# EAGLE design picotouch_synth (EAGLE 9.6.2)
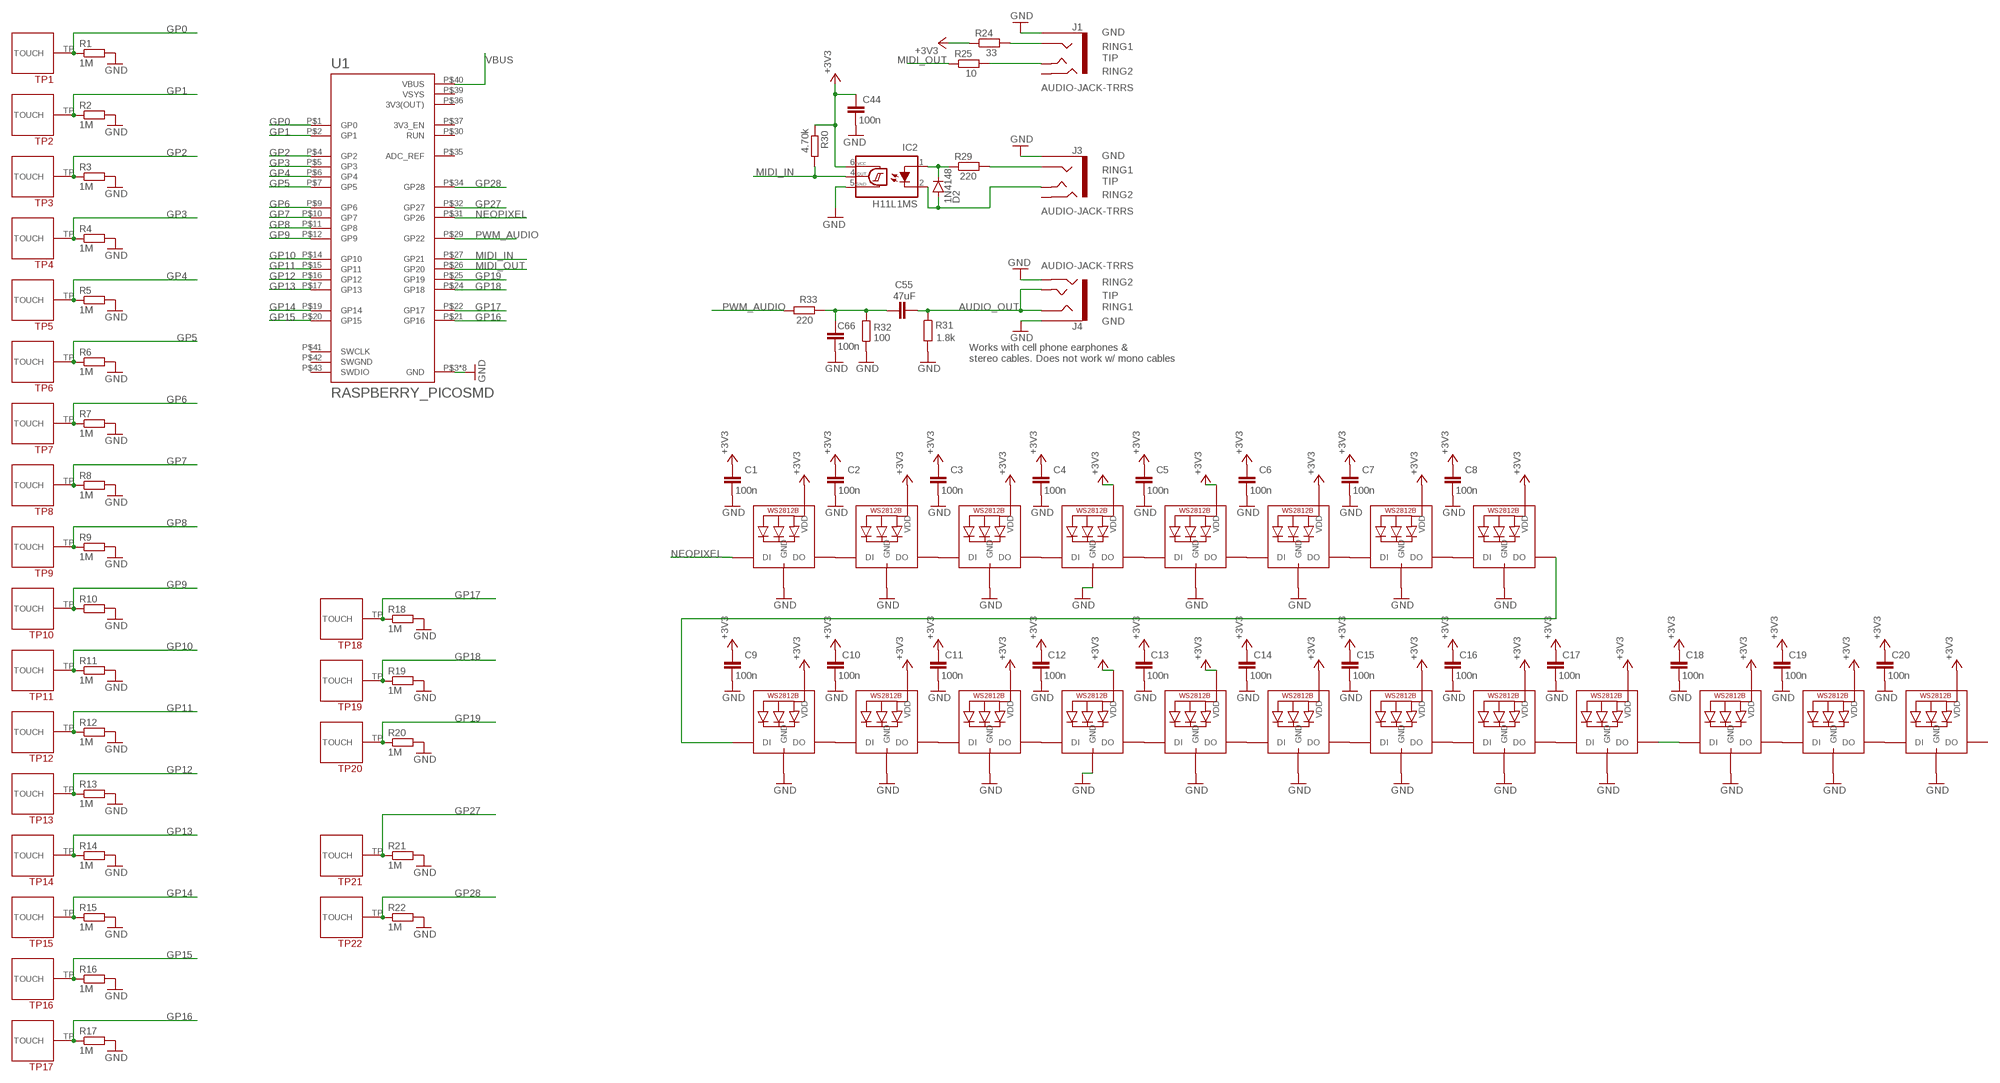
[diagram p0: schematic, sheet 1]

## Parts
C1  100n  C-EUC0603  [C0603]
C2  100n  C-EUC0603  [C0603]
C3  100n  C-EUC0603  [C0603]
C4  100n  C-EUC0603  [C0603]
C5  100n  C-EUC0603  [C0603]
C6  100n  C-EUC0603  [C0603]
C7  100n  C-EUC0603  [C0603]
C8  100n  C-EUC0603  [C0603]
C9  100n  C-EUC0603  [C0603]
C10  100n  C-EUC0603  [C0603]
C11  100n  C-EUC0603  [C0603]
C12  100n  C-EUC0603  [C0603]
C13  100n  C-EUC0603  [C0603]
C14  100n  C-EUC0603  [C0603]
C15  100n  C-EUC0603  [C0603]
C16  100n  C-EUC0603  [C0603]
C17  100n  C-EUC0603  [C0603]
C18  100n  C-EUC0603  [C0603]
C19  100n  C-EUC0603  [C0603]
C20  100n  C-EUC0603  [C0603]
C44  100n  C-EUC0603  [C0603]
C55  47uF  C-EUC0603  [C0603]
C66  100n  C-EUC0603  [C0603]
D2  1N4148  DIODE-SOD123  [SOD123]
IC2  H11L1MS  [DIL6-SMD]
J1  AUDIO-JACK-TRRS  [PJ-320D_SPARKFUN]
J3  AUDIO-JACK-TRRS  [PJ-320D_SPARKFUN]
J4  AUDIO-JACK-TRRS  [PJ-320D_SPARKFUN]
LED1  WS2812B3535  [LED3535]
LED2  WS2812B3535  [LED3535]
LED3  WS2812B3535  [LED3535]
LED4  WS2812B3535  [LED3535]
LED5  WS2812B3535  [LED3535]
LED6  WS2812B3535  [LED3535]
LED7  WS2812B3535  [LED3535]
LED8  WS2812B3535  [LED3535]
LED9  WS2812B3535  [LED3535]
LED10  WS2812B3535  [LED3535]
LED11  WS2812B3535  [LED3535]
LED12  WS2812B3535  [LED3535]
LED13  WS2812B3535  [LED3535]
LED14  WS2812B3535  [LED3535]
LED15  WS2812B3535  [LED3535]
LED16  WS2812B3535  [LED3535]
LED17  WS2812B3535  [LED3535]
LED18  WS2812B3535  [LED3535]
LED19  WS2812B3535  [LED3535]
LED20  WS2812B3535  [LED3535]
R1  1M  R-EU_R0805  [R0805]
R2  1M  R-EU_R0805  [R0805]
R3  1M  R-EU_R0805  [R0805]
R4  1M  R-EU_R0805  [R0805]
R5  1M  R-EU_R0805  [R0805]
R6  1M  R-EU_R0805  [R0805]
R7  1M  R-EU_R0805  [R0805]
R8  1M  R-EU_R0805  [R0805]
R9  1M  R-EU_R0805  [R0805]
R10  R-EU_R0805  [R0805]
R11  1M  R-EU_R0805  [R0805]
R12  1M  R-EU_R0805  [R0805]
R13  1M  R-EU_R0805  [R0805]
R14  1M  R-EU_R0805  [R0805]
R15  1M  R-EU_R0805  [R0805]
R16  1M  R-EU_R0805  [R0805]
R17  1M  R-EU_R0805  [R0805]
R18  1M  R-EU_R0603  [R0603]
R19  1M  R-EU_R0603  [R0603]
R20  1M  R-EU_R0603  [R0603]
R21  1M  R-EU_R0603  [R0603]
R22  1M  R-EU_R0603  [R0603]
R24  33  R-EU_R0603  [R0603]
R25  10  R-EU_R0603  [R0603]
R29  220  R-EU_R0603  [R0603]
R30  4.70k  R-EU_R0603  [R0603]
R31  1.8k  R-EU_R0603  [R0603]
R32  100  R-EU_R0603  [R0603]
R33  220  R-EU_R0603  [R0603]
TP1  TOUCHPADA  [TOUCHPADA]
TP2  TOUCHPADA  [TOUCHPADA]
TP3  TOUCHPADA  [TOUCHPADA]
TP4  TOUCHPADA  [TOUCHPADA]
TP5  TOUCHPADA  [TOUCHPADA]
TP6  TOUCHPADA  [TOUCHPADA]
TP7  TOUCHPADA  [TOUCHPADA]
TP8  TOUCHPADA  [TOUCHPADA]
TP9  TOUCHPADA  [TOUCHPADA]
TP10  TOUCHPADA  [TOUCHPADA]
TP11  TOUCHPADA  [TOUCHPADA]
TP12  TOUCHPADA  [TOUCHPADA]
TP13  TOUCHPADA  [TOUCHPADA]
TP14  TOUCHPADA  [TOUCHPADA]
TP15  TOUCHPADA  [TOUCHPADA]
TP16  TOUCHPADA  [TOUCHPADA]
TP17  TOUCHPADA  [TOUCHPADA]
TP18  TOUCHPADB  [TOUCHPADB]
TP19  TOUCHPADB  [TOUCHPADB]
TP20  TOUCHPADB  [TOUCHPADB]
TP21  TOUCHPADB  [TOUCHPADB]
TP22  TOUCHPADB  [TOUCHPADB]
U1  RASPBERRY_PICOSMD  [PICO-PKG-SMD]

## Nets
+3V3: C1.1 C2.1 C3.1 C4.1 C5.1 C6.1 C7.1 C8.1 C9.1 C10.1 C11.1 C12.1 C13.1 C14.1 C15.1 C16.1 C17.1 C18.1 C19.1 C20.1 C44.1 IC2.6(VCC) LED1.2(VDD) LED2.2(VDD) LED3.2(VDD) LED4.2(VDD) LED5.2(VDD) LED6.2(VDD) LED7.2(VDD) LED8.2(VDD) LED9.2(VDD) LED10.2(VDD) LED11.2(VDD) LED12.2(VDD) LED13.2(VDD) LED14.2(VDD) LED15.2(VDD) LED16.2(VDD) LED17.2(VDD) LED18.2(VDD) LED19.2(VDD) LED20.2(VDD) R24.1 R30.1
AUDIO_OUT: C55.2 J4.RING1 J4.TIP R31.1
GND: C1.2 C2.2 C3.2 C4.2 C5.2 C6.2 C7.2 C8.2 C9.2 C10.2 C11.2 C12.2 C13.2 C14.2 C15.2 C16.2 C17.2 C18.2 C19.2 C20.2 C44.2 C66.2 IC2.5(GND) J1.EARTH J3.EARTH J4.EARTH J4.RING2 LED1.4(GND) LED2.4(GND) LED3.4(GND) LED4.4(GND) LED5.4(GND) LED6.4(GND) LED7.4(GND) LED8.4(GND) LED9.4(GND) LED10.4(GND) LED11.4(GND) LED12.4(GND) LED13.4(GND) LED14.4(GND) LED15.4(GND) LED16.4(GND) LED17.4(GND) LED18.4(GND) LED19.4(GND) LED20.4(GND) R1.2 R2.2 R3.2 R4.2 R5.2 R6.2 R7.2 R8.2 R9.2 R10.2 R11.2 R12.2 R13.2 R14.2 R15.2 R16.2 R17.2 R18.2 R19.2 R20.2 R21.2 R22.2 R31.2 R32.1 U1.P$3(GND) U1.P$8(GND) U1.P$13(GND) U1.P$18(GND) U1.P$23(GND) U1.P$28(GND) U1.P$33(GND) U1.P$38(GND)
GP0: R1.1 TP1.TP(TOUCH) U1.P$1(GP0)
GP1: R2.1 TP2.TP(TOUCH) U1.P$2(GP1)
GP2: R3.1 TP3.TP(TOUCH) U1.P$4(GP2)
GP3: R4.1 TP4.TP(TOUCH) U1.P$5(GP3)
GP4: R5.1 TP5.TP(TOUCH) U1.P$6(GP4)
GP5: R6.1 TP6.TP(TOUCH) U1.P$7(GP5)
GP6: R7.1 TP7.TP(TOUCH) U1.P$9(GP6)
GP7: R8.1 TP8.TP(TOUCH) U1.P$10(GP7)
GP8: R9.1 TP9.TP(TOUCH) U1.P$11(GP8)
GP9: R10.1 TP10.TP(TOUCH) U1.P$12(GP9)
GP10: R11.1 TP11.TP(TOUCH) U1.P$14(GP10)
GP11: R12.1 TP12.TP(TOUCH) U1.P$15(GP11)
GP12: R13.1 TP13.TP(TOUCH) U1.P$16(GP12)
GP13: R14.1 TP14.TP(TOUCH) U1.P$17(GP13)
GP14: R15.1 TP15.TP(TOUCH) U1.P$19(GP14)
GP15: R16.1 TP16.TP(TOUCH) U1.P$20(GP15)
GP16: R17.1 TP17.TP(TOUCH) U1.P$21(GP16)
GP17: R18.1 TP18.TP(TOUCH) U1.P$22(GP17)
GP18: R19.1 TP19.TP(TOUCH) U1.P$24(GP18)
GP19: R20.1 TP20.TP(TOUCH) U1.P$25(GP19)
GP27: R21.1 TP21.TP(TOUCH) U1.P$32(GP27)
GP28: R22.1 TP22.TP(TOUCH) U1.P$34(GP28)
MIDI_IN: IC2.4(OUT) R30.2 U1.P$27(GP21)
MIDI_OUT: R25.1 U1.P$26(GP20)
N$1: D2.C IC2.1(A) R29.1
N$2: J1.TIP R25.2
N$3: D2.A IC2.2(C) J3.TIP
N$4: J3.RING1 R29.2
N$5: C55.1 C66.1 R32.2 R33.1
N$6: J1.RING1 R24.2
N$7: LED1.3(DO) LED2.1(DI)
N$8: LED4.3(DO) LED5.1(DI)
N$9: LED5.3(DO) LED6.1(DI)
N$10: LED6.3(DO) LED7.1(DI)
N$11: LED7.3(DO) LED8.1(DI)
N$12: LED2.3(DO) LED3.1(DI)
N$13: LED3.3(DO) LED4.1(DI)
N$14: LED9.3(DO) LED10.1(DI)
N$15: LED12.3(DO) LED13.1(DI)
N$16: LED13.3(DO) LED14.1(DI)
N$17: LED14.3(DO) LED15.1(DI)
N$18: LED15.3(DO) LED16.1(DI)
N$19: LED10.3(DO) LED11.1(DI)
N$20: LED11.3(DO) LED12.1(DI)
N$21: LED8.3(DO) LED9.1(DI)
N$22: LED16.3(DO) LED17.1(DI)
N$23: LED18.3(DO) LED19.1(DI)
N$25: LED19.3(DO) LED20.1(DI)
N$26: LED17.3(DO) LED18.1(DI)
NEOPIXEL: LED1.1(DI) U1.P$31(GP26)
PWM_AUDIO: R33.2 U1.P$29(GP22)
VBUS: U1.P$40(VBUS)
Unconnected: J1.RING2 J3.RING2 LED20.3(DO) U1.P$30(RUN) U1.P$35(ADC_REF) U1.P$37(3V3_EN) U1.P$41(SWCLK) U1.P$43(SWDIO)

## Notes on the sheet
- GND
- RING1
- TIP
- RING2
- GND
- RING1
- TIP
- RING2
- RING2
- TIP
- RING1
- GND
- Works with cell phone earphones &
  stereo cables. Does not work w/ mono cables

## Power pins joined to a net without a drawn wire
3V3(OUT): U1.P$36(3V3(OUT))
SWGND: U1.P$42(SWGND)
VSYS: U1.P$39(VSYS)

## Library data of the parts
C1-C20 C44 C55 C66 = rcl:C-EU: CAPACITOR, European symbol; SPICEPREFIX: C
D2 = diode:DIODE-: DIODE
IC2 = optocoupler:H11L*M: 6-Pin DIP Optocoupler Source: http://www.fairchildsemi.com/ds/H1/H11L2-M.pdf; LCSC: C78589; MPN2: H11L1S; OC_FARNELL: unknown; OC_NEWARK: unknown
J1 J3 J4 = audio_jacks_todbot:AUDIO-JACK-TRRS; LCSC: C431535; MPN: PJ-320D
LED1-LED20 = todstuff2023:WS2812B
R1-R22 R24 R25 R29-R33 = rcl:R-EU_: RESISTOR, European symbol; SPICEPREFIX: R
TP1-TP22 = todstuff:TOUCHPAD
U1 = RpiPico:RASPBERRY_PICO: Raspberry Pi Pico

## Net classes
1 power: width 0.305 mm

## Board
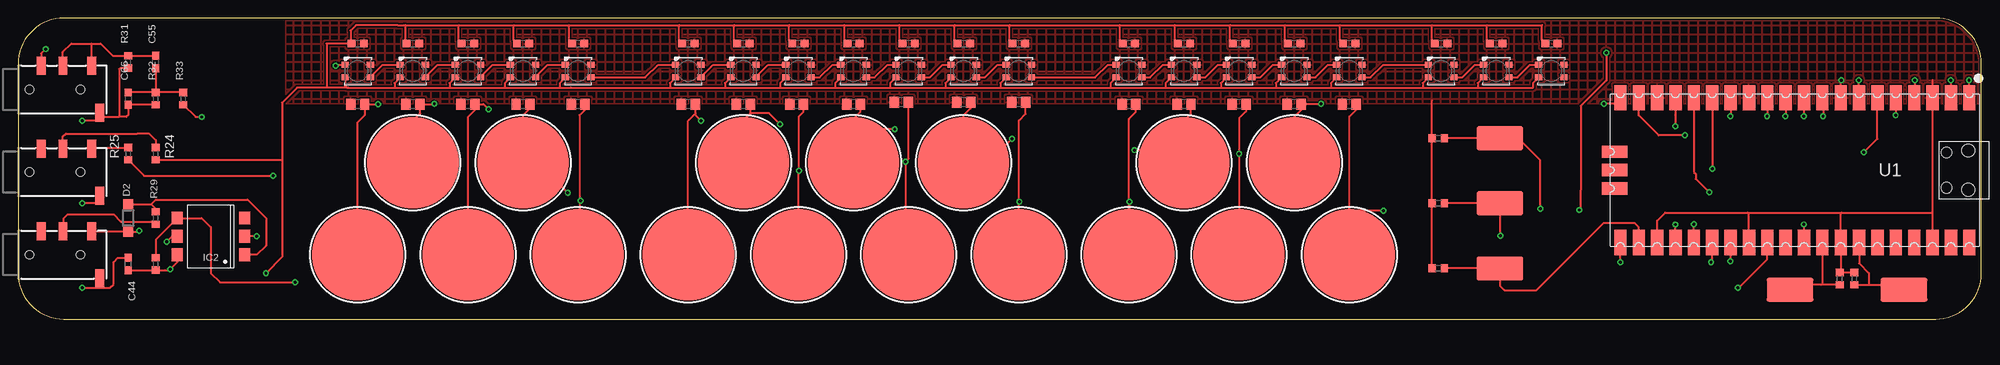
[diagram p1: board, top side]
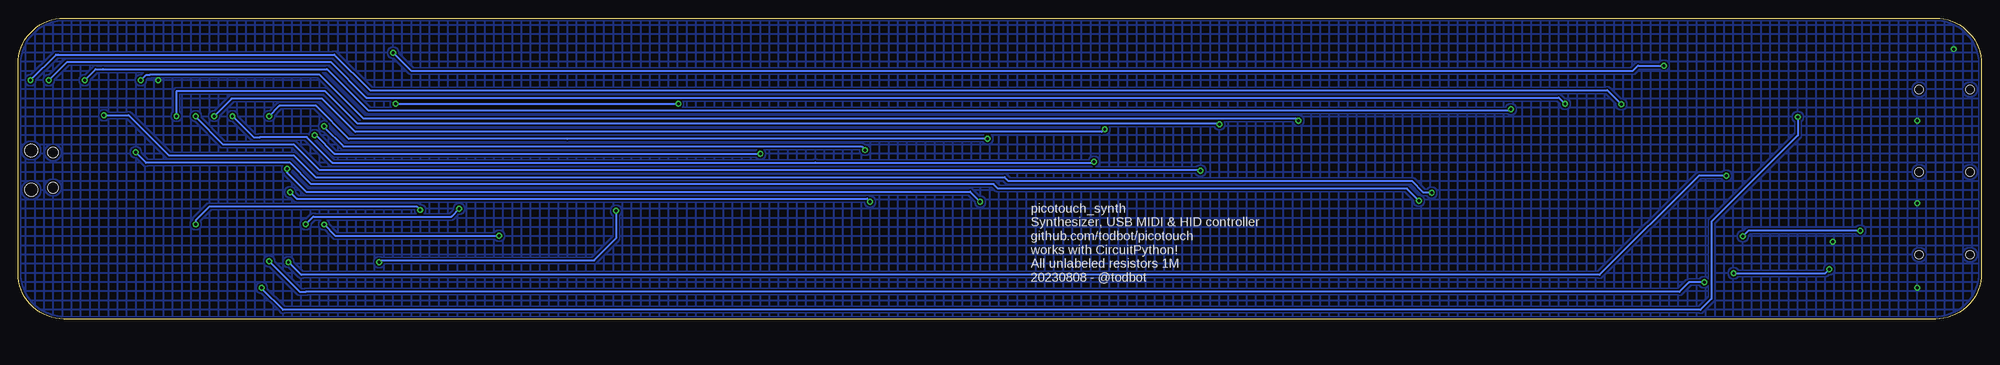
[diagram p2: board, bottom side, seen from below]

Size 271.59 x 41.62 mm. Coordinates in mm from the lower left corner, seen from the top.
Outline: 0,35.27 0,6.35 arc90 6.35,0 265.24,0 arc90 271.59,6.35 271.59,35.27 arc90 265.24,41.62 6.35,41.62 arc90 0,35.27
Copper layers (1*16): Top 0.035mm / dielectric 1.5mm / Bottom 0.035mm
Design rules "adafruit-rules-20180530 *": minimum track width 10mil, minimum drill 16mil, track to track 8mil, track to pad 8mil, pad to pad 8mil, via to via 8mil, smd to smd 8mil, copper to edge 10mil, drill to drill 8mil, minimum pad ring 10mil, minimum via ring 8mil, stop-mask expansion 4mil, vias tented up to drill 20mil, thermal gap 10mil

### Footprints (pad centres in the part's own frame; a part is rotated, then mirrored left to right if it is on the bottom)
C0603 = smd 1.1 x 1: 1 -0.85,0; 2 0.85,0
SOD123 = smd 1.4 x 1.4: A 1.9,0; C -1.9,0
DIL6-SMD = smd 1.78 x 1.52: 1 -2.54,-4.645; 2 0,-4.645; 3 2.54,-4.645; 4 2.54,4.645; 5 0,4.645; 6 -2.54,4.645
PJ-320D_SPARKFUN = smd 1.2 x 2.5: EARTH 11.3,-3.25; RING1 6.2,3.25; RING2 3.2,3.25; TIP 10.2,3.25 | hole 1.2: 1.6,0; 8.6,0
LED3535 = smd 1 x 0.85: 1 -1.75,0.875; 2 -1.75,-0.875; 3 1.75,-0.875; 4 1.75,0.875
R0805 = smd 1.3 x 1.5: 1 -0.95,0; 2 0.95,0
R0603 = smd 1 x 1.1: 1 -0.85,0; 2 0.85,0
TOUCHPADA = smd 12.7 x 12.7: TP 0,0
TOUCHPADB = smd 6.452 x 3.251: TP 0,0
PICO-PKG-SMD = smd 3.5 x 1.7: P$1 -10,24.13; P$2 -10,21.59; P$3 -10,19.05; P$4 -10,16.51; P$5 -10,13.97; P$6 -10,11.43; P$7 -10,8.89; P$8 -10,6.35; P$9 -10,3.81; P$10 -10,1.27; P$11 -10,-1.27; P$12 -10,-3.81; P$13 -10,-6.35; P$14 -10,-8.89; P$15 -10,-11.43; P$16 -10,-13.97; P$17 -10,-16.51; P$18 -10,-19.05; P$19 -10,-21.59; P$20 -10,-24.13; P$21 10,-24.13; P$22 10,-21.59; P$23 10,-19.05; P$24 10,-16.51; P$25 10,-13.97; P$26 10,-11.43; P$27 10,-8.89; P$28 10,-6.35; P$29 10,-3.81; P$30 10,-1.27; P$31 10,1.27; P$32 10,3.81; P$33 10,6.35; P$34 10,8.89; P$35 10,11.43; P$36 10,13.97; P$37 10,16.51; P$38 10,19.05; P$39 10,21.59; P$40 10,24.13 | smd 1.7 x 3.5: P$41 -2.54,-24.925; P$42 0,-24.925; P$43 2.54,-24.925 | hole 1.8: -2.725,24; 2.725,24 | hole 1.5: -2.425,20.97; 2.425,20.97

### Placement (x,y rotation side)
C1  46.99,38.1 0 top
C2  54.61,38.1 0 top
C3  62.23,38.1 0 top
C4  69.85,38.1 0 top
C5  77.47,38.1 0 top
C6  92.71,38.1 0 top
C7  100.33,38.1 0 top
C8  107.95,38.1 0 top
C9  115.57,38.1 0 top
C10  123.19,38.1 0 top
C11  130.81,38.1 0 top
C12  138.43,38.1 0 top
C13  153.67,38.1 0 top
C14  161.29,38.1 0 top
C15  168.91,38.1 0 top
C16  176.53,38.1 0 top
C17  184.15,38.1 0 top
C18  196.85,38.1 0 top
C19  204.47,38.1 0 top
C20  212.09,38.1 0 top
C44  15.24,7.62 90 top
C55  19.05,35.56 90 top
C66  15.24,30.48 270 top
D2  15.24,13.97 270 top
IC2  26.67,11.43 90 top
J1  0,20.32 0 top
J3  0,8.89 0 top
J4  0,31.75 0 top
LED1  46.99,34.29 0 top
LED2  54.61,34.29 0 top
LED3  62.23,34.29 0 top
LED4  69.85,34.29 0 top
LED5  77.47,34.29 0 top
LED6  92.71,34.29 0 top
LED7  100.33,34.29 0 top
LED8  107.95,34.29 0 top
LED9  115.57,34.29 0 top
LED10  123.19,34.29 0 top
LED11  130.81,34.29 0 top
LED12  138.43,34.29 0 top
LED13  153.67,34.29 0 top
LED14  161.29,34.29 0 top
LED15  168.91,34.29 0 top
LED16  176.53,34.29 0 top
LED17  184.15,34.29 0 top
LED18  196.85,34.29 0 top
LED19  204.47,34.29 0 top
LED20  212.09,34.29 0 top
R1  [R0805]  46.99,29.72 180 top
R2  [R0805]  54.61,29.72 180 top
R3  [R0805]  62.23,29.72 180 top
R4  [R0805]  69.85,29.72 180 top
R5  [R0805]  77.47,29.72 180 top
R6  [R0805]  92.71,29.72 180 top
R7  [R0805]  100.33,29.72 180 top
R8  [R0805]  107.7,29.72 180 top
R9  [R0805]  115.57,29.72 180 top
R10  122.17,29.97 180 top
R11  [R0805]  130.81,29.97 180 top
R12  [R0805]  138.43,29.97 180 top
R13  [R0805]  153.67,29.72 180 top
R14  [R0805]  161.29,29.72 180 top
R15  [R0805]  168.91,29.72 180 top
R16  [R0805]  176.53,29.72 180 top
R17  [R0805]  184.15,29.72 180 top
R18  [R0603]  196.45,7 180 top
R19  [R0603]  196.45,16 180 top
R20  [R0603]  196.45,25 180 top
R21  [R0603]  251.97,5.59 90 top
R22  [R0603]  254,5.59 90 top
R24  19.05,22.86 90 top
R25  15.24,22.86 90 top
R29  19.05,13.97 270 top
R30  19.05,7.62 90 top
R31  15.24,35.56 270 top
R32  19.05,30.48 90 top
R33  22.86,30.48 270 top
TP1  46.99,8.89 0 top
TP2  54.61,21.59 0 top
TP3  62.23,8.89 0 top
TP4  69.85,21.59 0 top
TP5  77.47,8.89 0 top
TP6  92.71,8.89 0 top
TP7  100.33,21.59 0 top
TP8  107.95,8.89 90 top
TP9  115.57,21.59 0 top
TP10  123.19,8.89 0 top
TP11  130.81,21.59 0 top
TP12  138.43,8.89 0 top
TP13  153.67,8.89 0 top
TP14  161.29,21.59 0 top
TP15  168.91,8.89 0 top
TP16  176.53,21.59 0 top
TP17  184.15,8.89 0 top
TP18  204.98,7 0 top
TP19  204.98,16 0 top
TP20  204.98,25 0 top
TP21  245.11,4.06 0 top
TP22  260.86,4.06 0 top
U1  245.78,20.59 270 top

### Tracks (layer width: path | path; a pad name or v marks a point on that pad's centre or on a via)
+3V3  (via drill 0.41)
  Top 0.254: 53.59,40.64 53.34,40.64 52.49,40.64 46.74,40.64 45.97,39.88 45.97,38.1 C1.1 42.67,38.1 42.67,32 | 53.59,40.64 60.96,40.64 | 68.58,40.64 76.2,40.64 | 76.2,40.64 91.44,40.64 | 91.44,40.64 99.06,40.64 | 99.06,40.64 106.68,40.64 | C2.1 53.59,38.27 53.59,40.64 | LED1.2 45.24,32.23 45.47,32 45.72,32 | 45.72,32 52.07,32 | 52.07,32 59.69,32 | 59.69,32 67.31,32 | 67.31,32 74.93,32 | 74.93,32 76.45,32 90.17,32 | 90.17,32 97.79,32 | 97.79,32 105.41,32 | LED3.2 59.69,32.62 59.69,32 | LED2.2 52.07,32.62 52.07,32 | LED4.2 67.31,32.62 67.31,32 | LED5.2 74.93,32.62 74.93,32 | C6.1 91.44,38.52 91.44,40.64 | C7.1 99.06,38.52 99.06,40.64 | C8.1 106.68,38.52 106.68,40.64 | LED6.2 90.17,32.62 90.17,32 | LED7.2 97.79,32.62 97.79,32 | LED8.2 105.41,32.62 105.41,32 | 105.41,32 113.03,32 | 113.03,32 120.65,32 | 120.65,32 128.27,32 | 128.27,32 135.89,32 | 135.89,32 151.13,32 | 151.13,32 158.75,32 | 158.75,32 166.37,32 | 166.37,32 173.99,32 | 173.99,32 181.61,32 | 181.61,32 194.31,32 | 194.31,32 201.93,32 | 201.93,32 209.55,32 209.55,32.62 LED20.2 | 106.68,40.64 114.3,40.64 | 114.3,40.64 121.92,40.64 | 121.92,40.64 129.54,40.64 | 129.54,40.64 137.16,40.64 | 137.16,40.64 152.4,40.64 | 152.4,40.64 160.02,40.64 | 160.02,40.64 167.64,40.64 | 167.64,40.64 175.26,40.64 | 175.26,40.64 182.88,40.64 | 182.88,40.64 195.58,40.64 | 195.58,40.64 203.2,40.64 | C9.1 114.3,38.52 114.3,40.64 | C10.1 121.92,38.52 121.92,40.64 | C11.1 129.54,38.52 129.54,40.64 | C12.1 137.16,38.52 137.16,40.64 | C13.1 152.4,38.52 152.4,40.64 | C14.1 160.02,38.52 160.02,40.64 | C15.1 167.64,38.52 167.64,40.64 | C16.1 175.26,38.52 175.26,40.64 | C17.1 182.88,38.52 182.88,40.64 | C18.1 195.58,38.52 195.58,40.64
  Top 0.254: C19.1 203.2,38.52 203.2,40.64 | LED13.2 151.13,32.62 151.13,32 | LED14.2 158.75,32.62 158.75,32 | LED15.2 166.37,32.62 166.37,32 | LED16.2 173.99,32.62 173.99,32 | LED17.2 181.61,32.62 181.61,32 | LED18.2 194.31,32.62 194.31,32 | LED19.2 201.93,32.62 201.93,32 | C44.1 R30.1 20.32,6.77 20.92,6.77 v21.05,6.89 22.02,7.87 IC2.6 | 45.72,32 42.67,32 | 42.67,32 38.61,32 36.52,29.92 36.52,21.84 | 36.52,21.84 36.52,8.59 v34.29,6.35 | C5.1 76.2,38.52 76.2,40.64 | C4.1 68.58,38.52 68.58,40.64 | C3.1 60.96,38.52 60.96,40.64 | LED9.2 113.03,32.62 113.03,32 | LED10.2 120.65,32.62 120.65,32 | LED11.2 128.27,32.62 128.27,32 | LED12.2 135.89,32.62 135.89,32 | 60.96,40.64 68.58,40.64 | 203.2,40.64 210.82,40.64 210.82,38.52 C20.1 | R24.1 36.36,22.01 36.52,21.84
  Bottom 0.254: v34.29,6.35 21.59,6.35 v21.05,6.89
AUDIO_OUT
  Top 0.254: J4.RING1 6.2,36.93 7.37,38.1 10.16,38.1 | J4.TIP 10.16,35.04 10.16,38.1 | 10.16,38.1 11.43,38.1 13.12,36.41 R31.1 C55.2
GND  (via drill 0.41)
  Top 0.254: U1.P$38 264.83,14.86 | 264.83,14.86 U1.P$3 264.83,33.07 | 13.97,27.94 11.43,27.94 11.43,28.37 J4.EARTH 11.3,27.56 11.18,27.43 9.4,27.43 v8.89,27.43 | R32.1 C66.2 15.24,28.19 14.99,27.94 13.97,27.94 | U1.P$8 252.13,33.02 v252.22,33.02 | J1.EARTH 11.3,16 v8.89,16 | J3.EARTH 11.3,4.32 | v8.89,4.32 11.3,4.32 | 239.27,14.73 227.84,14.73 226.73,13.62 U1.P$23 | 239.27,14.73 239.43,14.57 U1.P$28 | 264.83,14.86 264.7,14.73 252.22,14.73 | 239.27,14.73 252.22,14.73 | 252.22,14.73 252.13,14.64 U1.P$33 252.13,6.44 252.73,6.44 | J4.RING2 3.2,36.73 v3.81,37.34 | R31.2 14.14,34.71 13.97,34.54 13.97,27.94 | R21.2 252.73,6.44 | 252.73,6.44 R22.2 | 11.3,4.32 12.7,4.32 13.21,4.83 13.21,7.87 13.8,8.47 C44.2 | v20.57,10.67 21.34,11.43 IC2.5 | R18.2 R19.2 R20.2 | R20.2 195.58,25.02 | 195.58,25.02 195.58,30.23 | R20.2 195.58,25.02
  pour Top (hatched): 37.1,42.62 273.84,42.62 273.84,29.75 37.1,29.75
  pour Bottom (hatched): 0,44.45 275.59,44.45 275.59,-3.81 0,-3.81
GP0  (via drill 0.41)
  Top 0.254: U1.P$1 269.91,32.98 v269.88,33.02 | v49.81,29.72 R1.1 47.94,28.19 46.92,27.18 46.92,8.96 TP1.TP
  Bottom 0.254: v49.81,29.72 51.75,31.66 222.91,31.66 227.83,36.58 266.06,36.58 266.32,36.58 v269.88,33.02
GP1  (via drill 0.41)
  Top 0.254: U1.P$2 267.33,30.62 v267.33,33.02 | TP2.TP 54.61,27.43 55.63,28.45 55.63,29.65 R2.1 57.56,29.72 v57.59,29.75
  Bottom 0.254: v57.59,29.75 58.47,30.62 223.41,30.62 228.35,35.56 263.52,35.56 264.8,35.56 v267.33,33.02
GP2  (via drill 0.41)
  Top 0.254: U1.P$4 262.38,30.68 v262.38,33.02 | TP3.TP 62.23,27.94 63.5,29.21 63.5,29.4 R3.1 64.37,29.72 v65.08,29
  Bottom 0.254: v65.08,29 65.21,28.87 223.18,28.87 228.85,34.54 259.84,34.54 260.86,34.54 v262.38,33.02
GP3  (via drill 0.41)
  Top 0.254: U1.P$5 259.75,28.23 v259.71,28.19 | R4.1 70.8,29.14 69.85,28.19 TP4.TP 71.92,21.59 v76.04,17.47
  Bottom 0.254: v76.04,17.47 77.16,17.47 78.79,19.1 134.62,19.1 135.13,19.61 230.43,19.61 233.43,22.61 250.7,22.61 256.29,28.19 v259.71,28.19
GP4  (via drill 0.41)
  Top 0.254: v255.33,23.05 257.21,24.93 U1.P$6 | R5.1 78.42,28.96 77.66,28.19 77.66,16.26 | 77.66,16.26 77.66,9.08 TP5.TP | v77.8,16.38 77.68,16.26 77.66,16.26
  Bottom 0.254: v77.8,16.38 79.45,18.03 136.01,18.03 136.66,18.67 231.01,18.67 233.93,21.59 253.87,21.59 v255.33,23.05
GP5  (via drill 0.41)
  Top 0.254: U1.P$7 254.63,30.62 v254.63,33.02 | TP6.TP 92.71,27.43 93.73,28.45 93.73,29.65 R6.1 93.66,28.26 v94.49,27.43
  Bottom 0.254: v254.63,33.02 253.87,33.78 253.37,33.78 229.87,33.78 223.83,27.74 94.79,27.74 v94.49,27.43
GP6  (via drill 0.41)
  Top 0.254: U1.P$9 249.68,30.5 v249.68,28.07 | TP7.TP 100.33,27.43 100.84,27.94 101.35,28.45 | 101.35,28.45 101.35,29.65 R7.1 | 101.35,28.45 103.89,28.45 v105.41,26.92
  Bottom 0.254: v105.41,26.92 105.49,27.01 224.62,27.01 229.11,31.5 249.68,31.5 v249.68,28.07
GP7  (via drill 0.41)
  Top 0.254: U1.P$10 247.05,28.1 v247.01,28.07 | TP8.TP 107.95,20.43 v108.02,20.5 108.02,28.01 108.65,28.64 R8.1
  Bottom 0.254: v108.02,20.5 108.14,20.62 229.91,20.62 233.43,24.13 243.21,24.13 247.01,27.94 v247.01,28.07
GP8  (via drill 0.41)
  Top 0.254: U1.P$11 244.51,28.1 v244.47,28.07 | R9.1 116.52,28.64 115.7,27.81 | 115.7,27.81 115.57,27.69 TP9.TP | 115.7,27.81 117.25,26.26 v121.27,26.26
  Bottom 0.254: v121.27,26.26 121.66,25.88 224.94,25.88 229.54,30.48 242.06,30.48 v244.47,28.07
GP9  (via drill 0.41)
  Top 0.254: TP10.TP 122.75,9.33 v122.75,21.75 123.19,22.19 123.19,29.91 R10.1 | U1.P$12 241.97,28.1 v241.94,28.07
  Bottom 0.254: v241.94,28.07 239.01,25.15 238.12,25.15 231.65,25.15 228.12,21.62 161.29,21.62 122.89,21.62 v122.75,21.75
GP10  (via drill 0.41)
  Top 0.254: U1.P$14 236.89,28.1 v236.85,28.07 | R11.1 131.76,29.14 130.81,28.19 TP11.TP 134.17,21.59 v137.5,24.91
  Bottom 0.254: v236.85,28.07 235.46,29.46 230.38,29.46 225.83,24.91 195.58,24.91 v137.5,24.91
GP11  (via drill 0.41)
  Top 0.254: v138.5,16.24 138.43,16.17 TP12.TP 138.43,27.43 139.38,28.38 R12.1 | U1.P$15 v234.35,20.78 v234.36,20.77
  Bottom 0.254: v138.5,16.24 139.89,17.63 231.75,17.63 234.36,20.24 v234.36,20.77
GP12  (via drill 0.41)
  Top 0.254: v153.73,16.23 153.73,8.95 TP13.TP 153.67,27.69 154.62,28.64 R13.1 | U1.P$16 231.81,20.32 232.06,20.07 232.06,19.4 v233.93,17.53
  Bottom 0.254: v153.73,16.23 154.14,16.64 233.04,16.64 v233.93,17.53
GP13  (via drill 0.41)
  Top 0.254: U1.P$17 229.27,28.23 229.24,28.19 v229.24,26.67 | R14.1 162.24,28.38 161.29,27.43 | 161.29,27.43 161.54,27.69 | 161.54,27.69 161.67,27.81 161.29,27.43 | 161.29,27.43 161.54,27.69 | 161.29,27.43 TP14.TP 159.51,23.37 v154.43,23.37
  Bottom 0.254: v229.24,26.67 229.24,26.54 226.57,23.88 154.94,23.88 v154.43,23.37
GP14  (via drill 0.41)
  Top 0.254: R15.1 169.86,28.7 168.91,27.75 v168.91,22.86 TP15.TP | v230.54,25.39 226.95,25.39 224.19,28.16 U1.P$19
  Bottom 0.254: v230.54,25.39 230.37,25.39 227.84,22.86 v168.91,22.86
GP15  (via drill 0.41)
  Top 0.254: U1.P$20 220.81,29.75 v219.35,29.75 | v180.25,29.75 180.22,29.72 R16.1 177.55,29.65 177.55,28.96 176.53,27.94 TP16.TP
  Bottom 0.254: v219.35,29.75 v180.25,29.75
GP16  (via drill 0.41)
  Top 0.254: R17.1 185.1,28.96 184.15,28.01 TP17.TP 184.15,14.22 184.91,14.99 v188.85,14.99 | v221.65,7.87 U1.P$21
  Bottom 0.254: v221.65,7.87 221.39,8.13 191.9,8.13 188.85,11.18 v188.85,14.99
GP17
  Top 0.254: R18.1 TP18.TP 204.98,4.62 205.6,4 210.03,4 219.34,13.31 223.6,13.31 224.19,12.72 U1.P$22
GP18  (via drill 0.41)
  Top 0.254: R19.1 TP19.TP 204.98,11.5 v205.03,11.5 | U1.P$24 v229.27,13.07
  Bottom 0.254: v229.27,13.07 227.7,11.5 v205.03,11.5
GP19  (via drill 0.41)
  Top 0.254: R20.1 TP20.TP 207.54,25 210.57,21.97 v210.57,15.24 | U1.P$25 v231.81,13.09
  Bottom 0.254: v210.57,15.24 211.65,14.16 230.74,14.16 v231.81,13.09
GP27
  Top 0.254: U1.P$32 249.59,8.89 249.59,4.9 249.43,4.74 | TP21.TP 245.62,4.57 245.78,4.74 249.43,4.74 | R21.1 249.43,4.74
GP28
  Top 0.254: R22.1 255.78,4.74 256.03,4.74 | 256.03,4.74 259.68,4.74 260.22,4.19 260.22,4.7 TP22.TP | U1.P$34 254.67,7.71 256.03,6.35 256.03,4.74
MIDI_IN  (via drill 0.41)
  Top 0.254: U1.P$27 236.85,10.55 v236.85,8 | R30.2 19.05,10.99 IC2.4 25.4,13.97 26.67,12.7 26.67,6.35 27.94,5.08 v38.35,5.08
  Bottom 0.254: v38.35,5.08 40.45,5.08 41.77,3.76 231.78,3.76 232.61,3.76 v236.85,8
MIDI_OUT  (via drill 0.41)
  Top 0.254: R25.1 17.44,19.81 v35.31,19.81 | v234.19,7.87 234.35,8.04 U1.P$26
  Bottom 0.254: v35.31,19.81 39.12,19.81 52.83,6.1 232.41,6.1 v234.19,7.87
N$1
  Top 0.254: D2.C 18.42,15.87 | 18.42,15.87 19.05,15.24 R29.1 | 18.42,15.87 19.06,16.51 31.75,16.51 34.29,13.97 34.29,10.16 33.02,8.89 IC2.1
N$2
  Top 0.254: J1.TIP 10.34,23.71 R25.2
N$3  (via drill 0.41)
  Top 0.254: J3.TIP 15.17,12.14 D2.A 16.64,12.07 v16.76,12.19 | v33.02,11.43 IC2.2
  Bottom 0.254: v16.76,12.19 32.26,12.19 v33.02,11.43
N$4
  Top 0.254: J3.RING1 6.35,12.29 6.35,13.97 6.86,14.48 13.21,14.48 14.22,13.46 18.71,13.46 R29.2
N$5
  Top 0.254: R33.1 R32.2 | R32.2 C66.1 | C55.1 R32.2
N$6
  Top 0.254: J1.RING1 6.2,25.25 6.6,25.65 16.51,25.65 18.12,25.65 19.05,24.73 R24.2
N$7
  Top 0.254: LED1.3 48.74,33.5 50.41,35.16 LED2.1
N$8
  Top 0.254: LED4.3 71.6,33.5 73.27,35.16 LED5.1
N$9
  Top 0.254: LED5.3 86.75,33.41 88.5,35.16 LED6.1
N$10
  Top 0.254: LED6.3 94.46,33.5 96.12,35.16 LED7.1
N$11
  Top 0.254: LED7.3 102.08,33.5 103.75,35.16 LED8.1
N$12
  Top 0.254: LED2.3 56.36,33.5 58.02,35.16 LED3.1
N$13
  Top 0.254: LED3.3 63.98,33.5 65.64,35.16 LED4.1
N$14
  Top 0.254: LED9.3 118.5,33.41 120.25,35.16 LED10.1
N$15
  Top 0.254: LED12.3 148.99,33.41 150.74,35.16 LED13.1
N$16
  Top 0.254: LED13.3 156.6,33.41 158.35,35.16 LED14.1
N$17
  Top 0.254: LED14.3 164.22,33.41 165.97,35.16 LED15.1
N$18
  Top 0.254: LED15.3 171.84,33.41 173.59,35.16 LED16.1
N$19
  Top 0.254: LED10.3 126.12,33.41 127.88,35.16 LED11.1
N$20
  Top 0.254: LED11.3 133.75,33.41 135.5,35.16 LED12.1
N$21
  Top 0.254: LED8.3 110.89,33.41 112.64,35.16 LED9.1
N$22
  Top 0.254: LED16.3 179.47,33.41 181.22,35.16 LED17.1
N$23
  Top 0.254: LED18.3 199.78,33.41 201.53,35.16 LED19.1
N$25
  Top 0.254: LED19.3 207.41,33.41 209.16,35.16 LED20.1
N$26
  Top 0.254: LED17.3 187.09,33.41 188.84,35.16 LED18.1
NEOPIXEL  (via drill 0.41)
  Top 0.254: v43.92,35.05 44.03,35.16 LED1.1 | v219.71,36.83 219.71,33.02 216.15,29.46 216.15,17.78 216.15,15.25 v215.98,15.08 | v247.01,13.08 247.05,13.05 U1.P$31
  Bottom 0.254: v215.98,15.08 216.49,15.59 245.11,15.59 247.01,13.68 v247.01,13.08 | v43.92,35.05 47.5,35.05 48.26,34.29 217.17,34.29 v219.71,36.83
PWM_AUDIO  (via drill 0.41)
  Top 0.254: R33.2 24.55,27.94 v25.4,27.94 | v237.87,4.32 238,4.32 241.97,8.29 U1.P$29
  Bottom 0.254: v25.4,27.94 25.4,25.4 37.34,13.46 37.34,2.79 38.86,1.27 234.95,1.27 237.87,4.19 v237.87,4.32

### Text on the board
bPlace: picotouch_synth / Synthesizer, USB MIDI & HID controller / github.com/todbot/picotouch / works with CircuitPython! / All unlabeled resistors 1M / 20230808 - @todbot